# EAGLE design adc_cap (EAGLE 7.0.0)
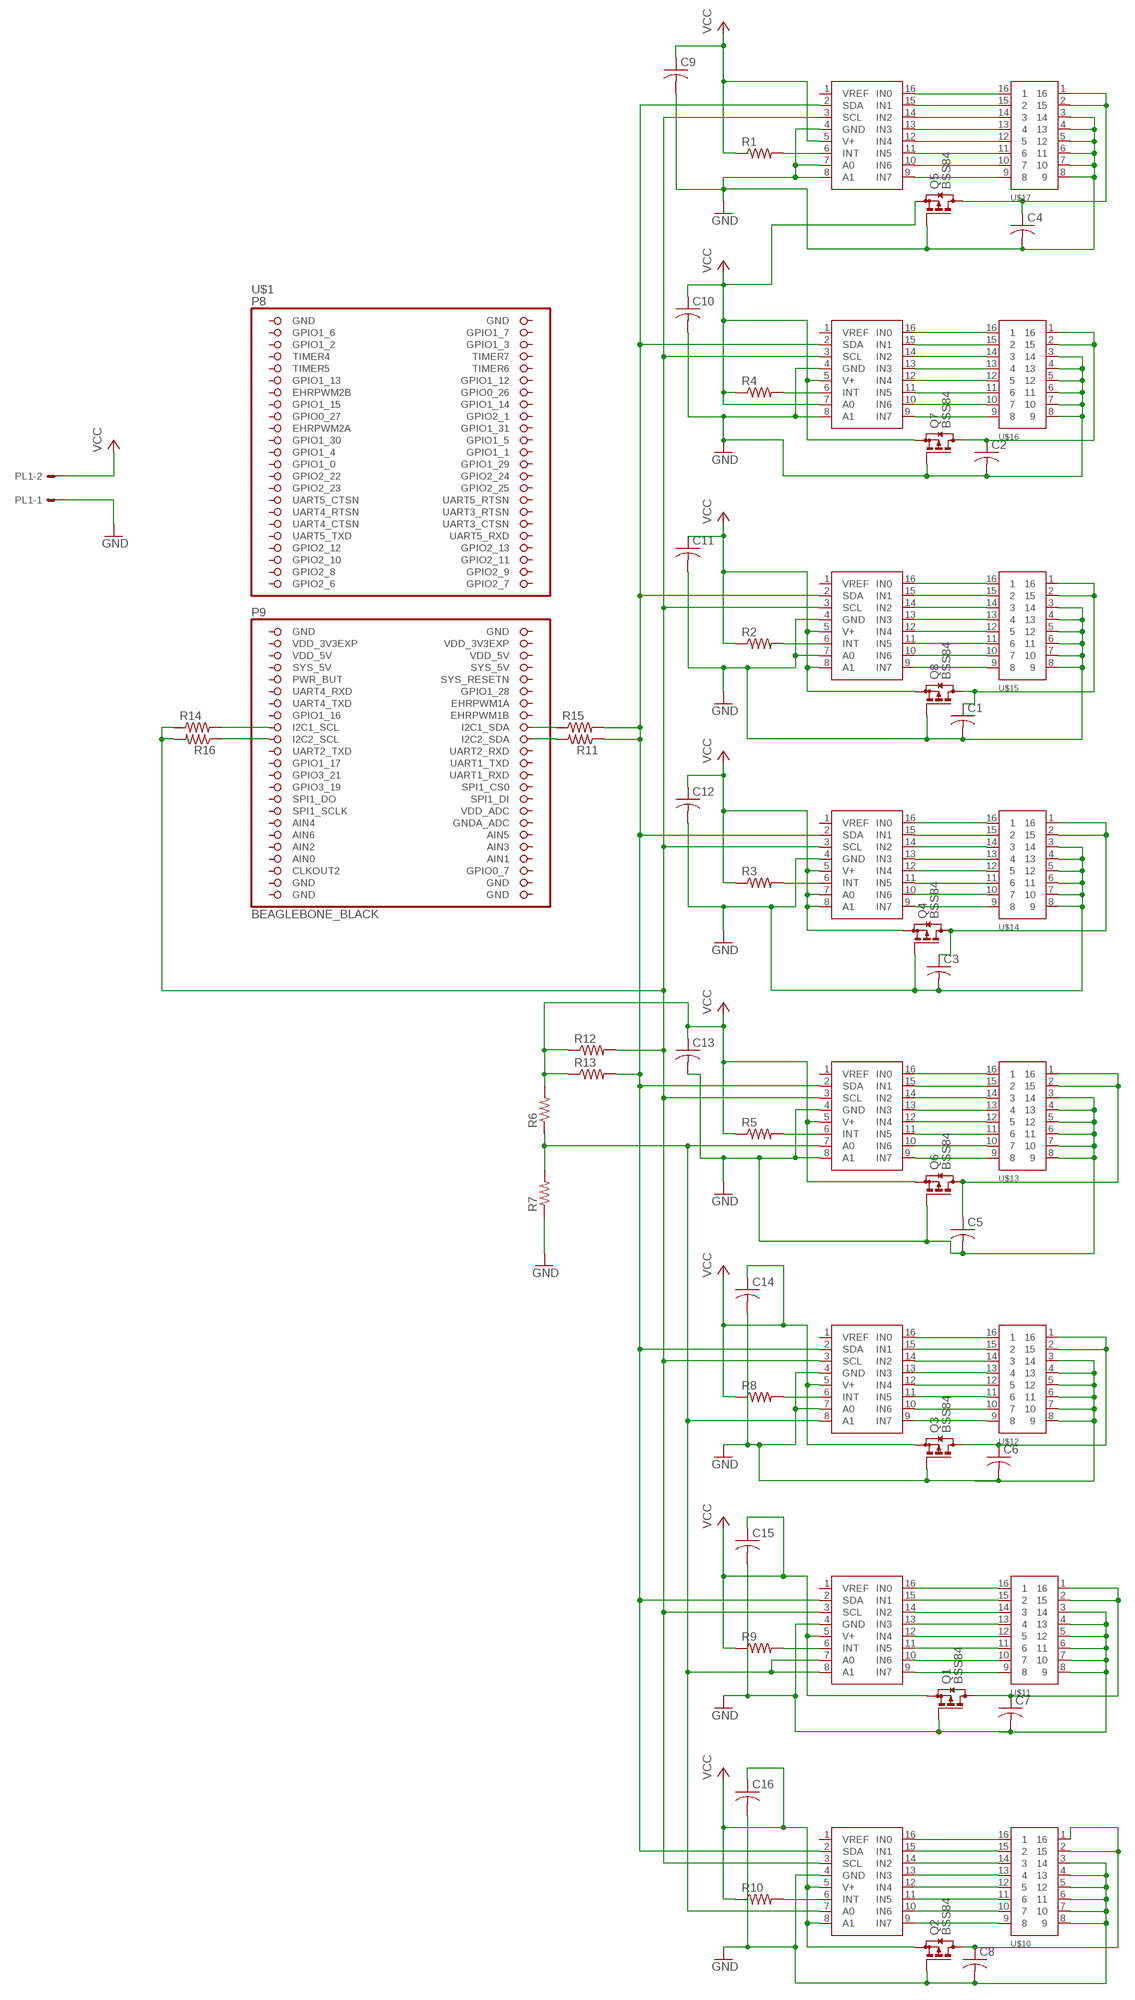
[diagram p0: schematic, sheet 1]

## Parts
C1  C-USC0805  [C0805]
C2  C-USC0805  [C0805]
C3  C-USC0805  [C0805]
C4  C-USC0805  [C0805]
C5  C-USC0805  [C0805]
C6  C-USC0805  [C0805]
C7  C-USC0805  [C0805]
C8  C-USC0805  [C0805]
C9  C-USC0805  [C0805]
C10  C-USC0805  [C0805]
C11  C-USC0805  [C0805]
C12  C-USC0805  [C0805]
C13  C-USC0805  [C0805]
C14  C-USC0805  [C0805]
C15  C-USC0805  [C0805]
C16  C-USC0805  [C0805]
PL1  555X-2H  [5569-2]
Q1  BSS84  [SOT23]
Q2  BSS84  [SOT23]
Q3  BSS84  [SOT23]
Q4  BSS84  [SOT23]
Q5  BSS84  [SOT23]
Q6  BSS84  [SOT23]
Q7  BSS84  [SOT23]
Q8  BSS84  [SOT23]
R1  R-US_R0805  [R0805]
R2  R-US_R0805  [R0805]
R3  R-US_R0805  [R0805]
R4  R-US_R0805  [R0805]
R5  R-US_R0805  [R0805]
R6  R-US_R0805  [R0805]
R7  R-US_R0805  [R0805]
R8  R-US_R0805  [R0805]
R9  R-US_R0805  [R0805]
R10  R-US_R0805  [R0805]
R11  R-US_R0805  [R0805]
R12  R-US_R0805  [R0805]
R13  R-US_R0805  [R0805]
R14  R-US_R0805  [R0805]
R15  R-US_R0805  [R0805]
R16  R-US_R0805  [R0805]
U$1  BEAGLEBONE_BLACK  [BEAGEBONE]
U$2  ADC128D818  [ADC12_SD]
U$3  ADC128D818  [ADC12_SD]
U$4  ADC128D818  [ADC12_SD]
U$5  ADC128D818  [ADC12_SD]
U$6  ADC128D818  [ADC12_SD]
U$7  ADC128D818  [ADC12_SD]
U$8  ADC128D818  [ADC12_SD]
U$9  ADC128D818  [ADC12_SD]
U$10  2_X_8_CON  [2_X_8_PIN]
U$11  2_X_8_CON  [2_X_8_PIN]
U$12  2_X_8_CON  [2_X_8_PIN]
U$13  2_X_8_CON  [2_X_8_PIN]
U$14  2_X_8_CON  [2_X_8_PIN]
U$15  2_X_8_CON  [2_X_8_PIN]
U$16  2_X_8_CON  [2_X_8_PIN]
U$17  2_X_8_CON  [2_X_8_PIN]

## Nets
GND: C1.2 C2.2 C3.2 C4.2 C5.2 C6.2 C7.2 C8.2 C9.2 C10.2 C11.2 C12.2 C13.2 C14.2 C15.2 C16.2 PL1.1 Q1.1(G) Q2.1(G) Q3.1(G) Q4.1(G) Q5.1(G) Q6.1(G) Q7.1(G) Q8.1(G) R7.1 U$2.4(GND) U$2.8(A1) U$3.4(GND) U$3.7(A0) U$3.8(A1) U$4.4(GND) U$4.7(A0) U$5.4(GND) U$6.4(GND) U$6.8(A1) U$7.4(GND) U$7.7(A0) U$8.4(GND) U$9.4(GND) U$10.3 U$10.4 U$10.5 U$10.6 U$10.7 U$10.8 U$11.3 U$11.4 U$11.5 U$11.6 U$11.7 U$11.8 U$12.3 U$12.4 U$12.5 U$12.6 U$12.7 U$12.8 U$13.3 U$13.4 U$13.5 U$13.6 U$13.7 U$13.8 U$14.3 U$14.4 U$14.5 U$14.6 U$14.7 U$14.8 U$15.3 U$15.4 U$15.5 U$15.6 U$15.7 U$15.8 U$16.3 U$16.4 U$16.5 U$16.6 U$16.7 U$16.8 U$17.3 U$17.4 U$17.5 U$17.6 U$17.7 U$17.8
N$1: U$3.16(IN0) U$17.16
N$2: U$3.15(IN1) U$17.15
N$3: U$3.14(IN2) U$17.14
N$4: U$3.13(IN3) U$17.13
N$5: U$3.12(IN4) U$17.12
N$6: U$3.11(IN5) U$17.11
N$7: U$3.10(IN6) U$17.10
N$8: U$3.9(IN7) U$17.9
N$9: U$9.16(IN0) U$10.16
N$10: U$9.15(IN1) U$10.15
N$11: U$9.14(IN2) U$10.14
N$12: U$9.13(IN3) U$10.13
N$13: U$9.12(IN4) U$10.12
N$14: U$9.11(IN5) U$10.11
N$15: U$9.10(IN6) U$10.10
N$16: U$9.9(IN7) U$10.9
N$17: U$8.16(IN0) U$11.16
N$18: U$8.15(IN1) U$11.15
N$19: R4.2 U$2.6(INT)
N$20: U$8.14(IN2) U$11.14
N$21: U$8.13(IN3) U$11.13
N$22: U$8.12(IN4) U$11.12
N$23: U$8.11(IN5) U$11.11
N$24: U$8.10(IN6) U$11.10
N$25: U$8.9(IN7) U$11.9
N$26: R2.2 U$4.6(INT)
N$27: U$7.16(IN0) U$12.16
N$28: U$7.15(IN1) U$12.15
N$29: U$7.14(IN2) U$12.14
N$30: U$7.13(IN3) U$12.13
N$31: U$7.12(IN4) U$12.12
N$32: U$7.11(IN5) U$12.11
N$33: U$7.10(IN6) U$12.10
N$34: U$7.9(IN7) U$12.9
N$35: R3.2 U$5.6(INT)
N$36: U$6.16(IN0) U$13.16
N$37: U$6.15(IN1) U$13.15
N$38: U$6.14(IN2) U$13.14
N$39: U$6.13(IN3) U$13.13
N$40: U$6.12(IN4) U$13.12
N$41: U$6.11(IN5) U$13.11
N$42: U$6.10(IN6) U$13.10
N$43: U$6.9(IN7) U$13.9
N$44: R5.2 U$6.6(INT)
N$45: R6.1 R7.2 U$6.7(A0) U$7.8(A1) U$8.7(A0) U$8.8(A1) U$9.7(A0)
N$46: U$5.16(IN0) U$14.16
N$47: U$5.15(IN1) U$14.15
N$48: U$5.14(IN2) U$14.14
N$49: U$5.13(IN3) U$14.13
N$50: U$5.12(IN4) U$14.12
N$51: U$5.11(IN5) U$14.11
N$52: U$5.10(IN6) U$14.10
N$53: U$5.9(IN7) U$14.9
N$54: R8.2 U$7.6(INT)
N$55: R12.2 R14.1 R16.2 U$2.3(SCL) U$3.3(SCL) U$4.3(SCL) U$5.3(SCL) U$6.3(SCL) U$7.3(SCL) U$8.3(SCL) U$9.3(SCL)
N$56: U$4.16(IN0) U$15.16
N$57: U$4.15(IN1) U$15.15
N$58: U$4.14(IN2) U$15.14
N$59: U$4.13(IN3) U$15.13
N$60: U$4.12(IN4) U$15.12
N$61: U$4.11(IN5) U$15.11
N$62: U$4.10(IN6) U$15.10
N$63: U$4.9(IN7) U$15.9
N$64: R9.2 U$8.6(INT)
N$65: U$2.16(IN0) U$16.16
N$66: U$2.15(IN1) U$16.15
N$67: R1.2 U$3.6(INT)
N$68: U$2.14(IN2) U$16.14
N$69: U$2.13(IN3) U$16.13
N$70: U$2.12(IN4) U$16.12
N$71: U$2.11(IN5) U$16.11
N$72: U$2.10(IN6) U$16.10
N$73: U$2.9(IN7) U$16.9
N$74: R10.2 U$9.6(INT)
N$75: C4.1 Q5.3(D) U$17.1 U$17.2
N$76: C3.1 Q4.3(D) U$14.1 U$14.2
N$77: C1.1 Q8.3(D) U$15.1 U$15.2
N$78: C7.1 Q1.3(D) U$11.1 U$11.2
N$79: C2.1 Q7.3(D) U$16.1 U$16.2
N$80: R11.2 U$1.167(I2C2_SDA)
N$81: R15.1 U$1.165(I2C1_SDA)
N$82: C5.1 Q6.3(D) U$13.1 U$13.2
N$83: C8.1 Q2.3(D) U$10.1 U$10.2
N$84: R11.1 R13.2 R15.2 U$2.2(SDA) U$3.2(SDA) U$4.2(SDA) U$5.2(SDA) U$6.2(SDA) U$7.2(SDA) U$8.2(SDA) U$9.2(SDA)
N$85: R14.2 U$1.168(I2C1_SCL)
N$86: R16.1 U$1.166(I2C2_SCL)
N$87: C6.1 Q3.3(D) U$12.1 U$12.2
VCC: C9.1 C10.1 C11.1 C12.1 C13.1 C14.1 C15.1 C16.1 PL1.2 Q1.2(S) Q2.2(S) Q3.2(S) Q4.2(S) Q5.2(S) Q6.2(S) Q7.2(S) Q8.2(S) R1.1 R2.1 R3.1 R4.1 R5.1 R6.2 R8.1 R9.1 R10.1 R12.1 R13.1 U$2.5(V+) U$2.7(A0) U$3.5(V+) U$4.5(V+) U$4.8(A1) U$5.5(V+) U$5.7(A0) U$5.8(A1) U$6.5(V+) U$7.5(V+) U$8.5(V+) U$9.5(V+) U$9.8(A1)
Unconnected: U$1.93(GPIO2_7) U$1.94(GPIO2_6) U$1.95(GPIO2_9) U$1.96(GPIO2_8) U$1.97(GPIO2_11) U$1.98(GPIO2_10) U$1.99(GPIO2_13) U$1.100(GPIO2_12) U$1.101(UART5_RXD) U$1.102(UART5_TXD) U$1.103(UART3_CTSN) U$1.104(UART4_CTSN) U$1.105(UART3_RTSN) U$1.106(UART4_RTSN) U$1.107(UART5_RTSN) U$1.108(UART5_CTSN) U$1.109(GPIO2_25) U$1.110(GPIO2_23) U$1.111(GPIO2_24) U$1.112(GPIO2_22) U$1.113(GPIO1_29) U$1.114(GPIO1_0) U$1.115(GPIO1_1) U$1.116(GPIO1_4) U$1.117(GPIO1_5) U$1.118(GPIO1_30) U$1.119(GPIO1_31) U$1.120(EHRPWM2A) U$1.121(GPIO2_1) U$1.122(GPIO0_27) U$1.123(GPIO1_14) U$1.124(GPIO1_15) U$1.125(GPIO0_26) U$1.126(EHRPWM2B) U$1.127(GPIO1_12) U$1.128(GPIO1_13) U$1.129(TIMER6) U$1.130(TIMER5) U$1.131(TIMER7) U$1.132(TIMER4) U$1.133(GPIO1_3) U$1.134(GPIO1_2) U$1.135(GPIO1_7) U$1.136(GPIO1_6) U$1.143(GPIO0_7) U$1.144(CLKOUT2) U$1.145(AIN1) U$1.147(AIN3) U$1.148(AIN2) U$1.149(AIN5) U$1.150(AIN6) U$1.151(GNDA_ADC) U$1.152(AIN4) U$1.153(VDD_ADC) U$1.154(SPI1_SCLK) U$1.155(SPI1_DI) U$1.156(SPI1_DO) U$1.157(SPI1_CS0) U$1.158(GPIO3_19) U$1.159(UART1_RXD) U$1.160(GPIO3_21) U$1.161(UART1_TXD) U$1.162(GPIO1_17) U$1.163(UART2_RXD) U$1.164(UART2_TXD) U$1.169(EHRPWM1B) U$1.170(GPIO1_16) U$1.171(EHRPWM1A) U$1.172(UART4_TXD) U$1.173(GPIO1_28) U$1.174(UART4_RXD) U$1.175(SYS_RESETN) U$1.176(PWR_BUT) U$1.177(SYS_5V) U$2.1(VREF) U$3.1(VREF) U$4.1(VREF) U$5.1(VREF) U$6.1(VREF) U$7.1(VREF) U$8.1(VREF) U$9.1(VREF)

## Power pins joined to a net without a drawn wire
AIN0: U$1.146(AIN0)
GND: U$1.137(GND) U$1.138(GND) U$1.139(GND) U$1.140(GND) U$1.141(GND) U$1.142(GND) U$1.183(GND) U$1.184(GND)
SYS_5V: U$1.178(SYS_5V)
VDD_3V3EXP: U$1.181(VDD_3V3EXP) U$1.182(VDD_3V3EXP)
VDD_5V: U$1.179(VDD_5V) U$1.180(VDD_5V)

## Library data of the parts
C1-C16 = rcl:C-US: CAPACITOR, American symbol
PL1 = con-molex-2:555X-2: Mini FIT connector 2 way
Q1-Q8 = transistor-small-signal:BSS84: P-CHANNEL MOS FET
R1-R10 R12 R13 = adafruit:R-US_: RESISTOR, American symbol
R11 R14-R16 = rcl:R-US_: RESISTOR, American symbol
U$1 = BeagleBone:BEAGLEBONE_BLACK
U$2-U$9 = ADC128D818:ADC128D818
U$10-U$17 = 11_pin_connecterp:2_X_8_CON

## Net classes
0 default: width 2.54 mm, drill 0.508 mm, clearance 0.254 mm

## Board
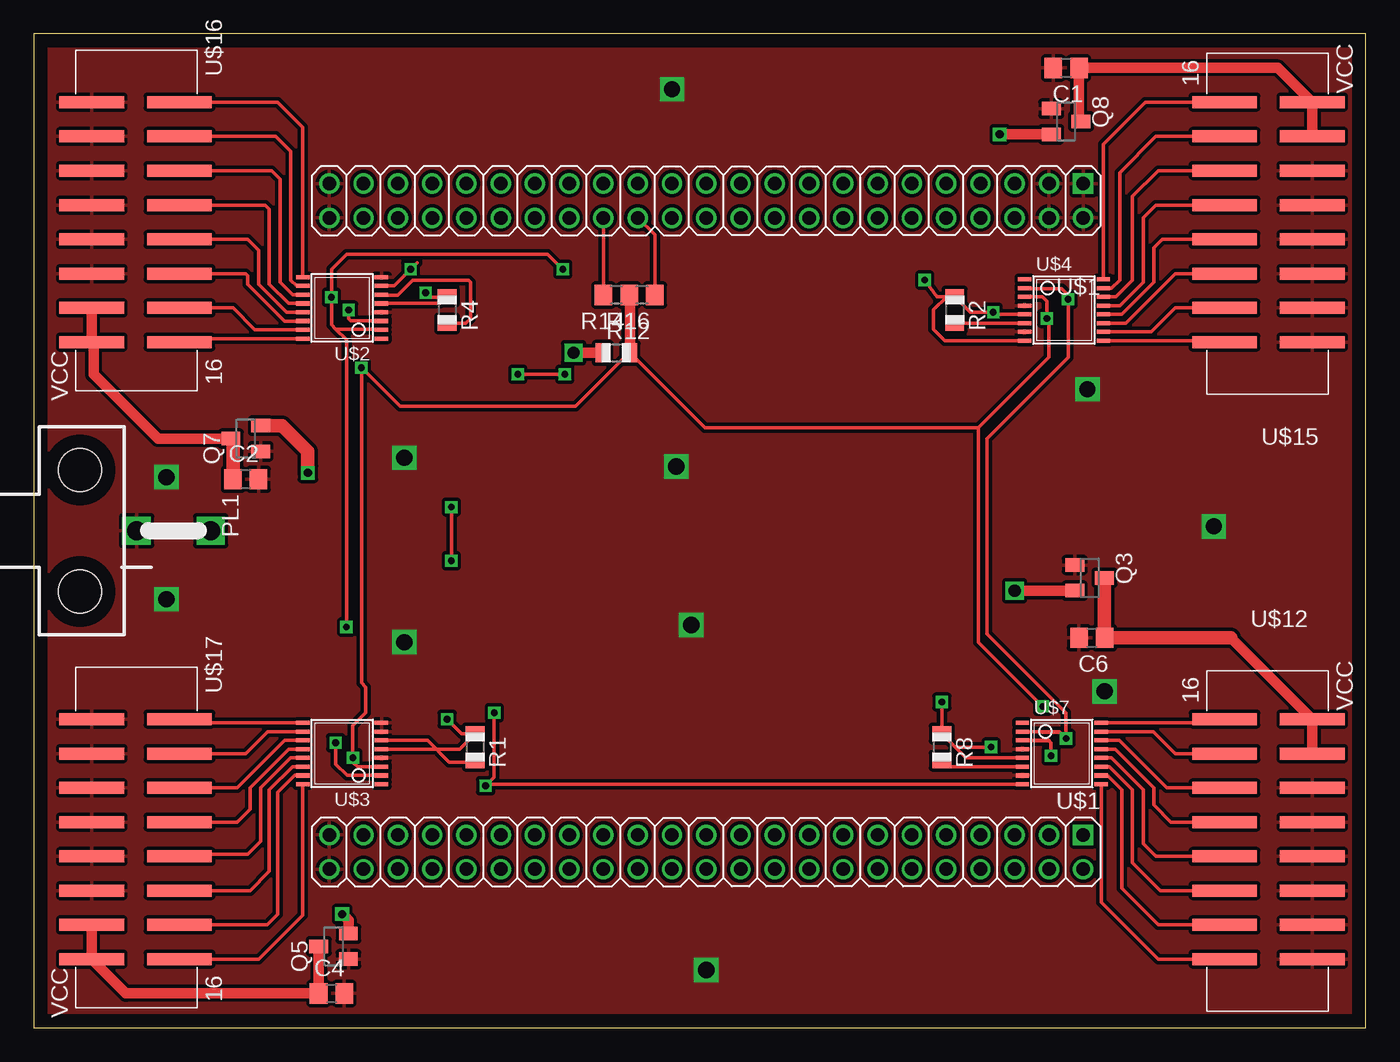
[diagram p1: board, top side]
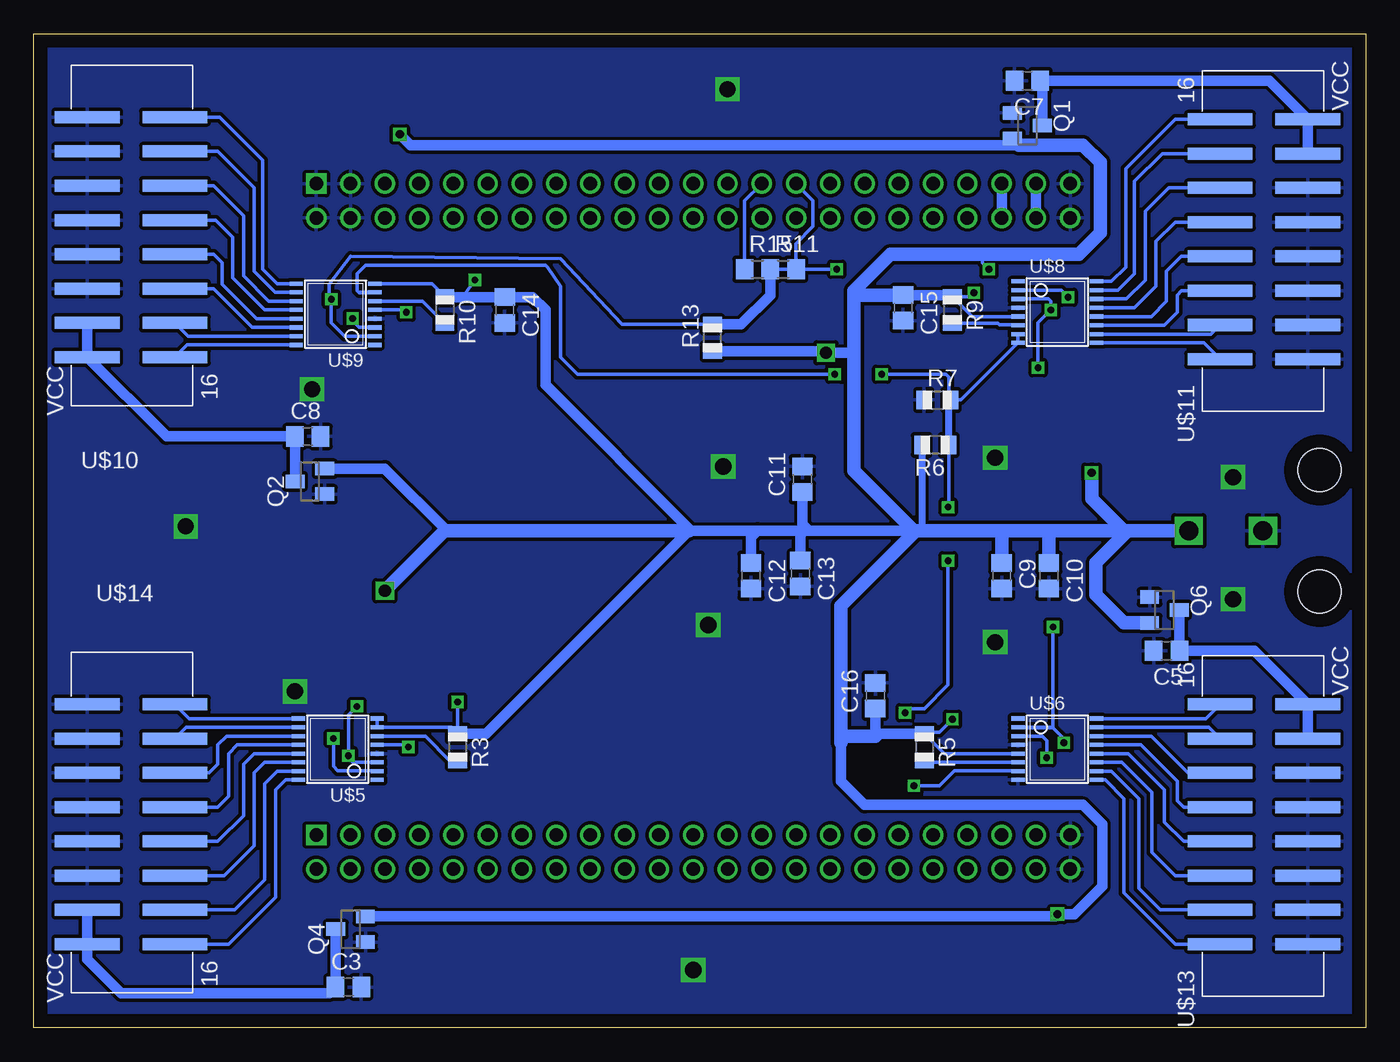
[diagram p2: board, bottom side, seen from below]

Size 98.73 x 73.65 mm. Coordinates in mm from the lower left corner, seen from the top.
Outline: 0,0 98.73,0 98.73,73.65 0,73.65 0,0
Copper layers (1*16): Top 0.035mm / dielectric 1.5mm / Bottom 0.035mm
Design rules "default": minimum track width 10mil, minimum drill 24mil, track to track 8mil, track to pad 8mil, pad to pad 8mil, via to via 8mil, smd to smd 8mil, copper to edge 40mil, drill to drill 8mil, minimum pad ring 10mil, minimum via ring 8mil, stop-mask expansion 4mil, vias tented up to drill 0mil, thermal gap 10mil

### Footprints (pad centres in the part's own frame; a part is rotated, then mirrored left to right if it is on the bottom)
C0805 = smd 1.3 x 1.5: 1 -0.95,0; 2 0.95,0
5569-2 = drill 1.4 square: 1 0,0; 2 0,5.5 | hole 3.2: 4.5,-4.2; -4.5,-4.2
SOT23 = smd 1 x 1.4: 1 -0.95,-1.1; 2 0.95,-1.1; 3 0,1.1
R0805 = smd 1.1 x 1.4: 1 -1,0; 2 1,0
R0805' = smd 1.3 x 1.5: 1 -0.95,0; 2 0.95,0
BEAGEBONE = drill 1 square: 93 -22.225,-33.02; 139 26.035,-33.02 | drill 1: 94 -24.765,-33.02; 95 -22.225,-30.48; 96 -24.765,-30.48; 97 -22.225,-27.94; 98 -24.765,-27.94; 99 -22.225,-25.4; 100 -24.765,-25.4; 101 -22.225,-22.86; 102 -24.765,-22.86; 103 -22.225,-20.32; 104 -24.765,-20.32; 105 -22.225,-17.78; 106 -24.765,-17.78; 107 -22.225,-15.24; 108 -24.765,-15.24; 109 -22.225,-12.7; 110 -24.765,-12.7; 111 -22.225,-10.16; 112 -24.765,-10.16; 113 -22.225,-7.62; 114 -24.765,-7.62; 115 -22.225,-5.08; 116 -24.765,-5.08; 117 -22.225,-2.54; 118 -24.765,-2.54; 119 -22.225,0; 120 -24.765,0; 121 -22.225,2.54; 122 -24.765,2.54; 123 -22.225,5.08; 124 -24.765,5.08; 125 -22.225,7.62; 126 -24.765,7.62; 127 -22.225,10.16; 128 -24.765,10.16; 129 -22.225,12.7; 130 -24.765,12.7; 131 -22.225,15.24; 132 -24.765,15.24; 133 -22.225,17.78; 134 -24.765,17.78; 135 -22.225,20.32; 136 -24.765,20.32; 137 -22.225,22.86; 138 -24.765,22.86; 140 23.495,-33.02; 141 26.035,-30.48; 142 23.495,-30.48; 143 26.035,-27.94; 144 23.495,-27.94; 145 26.035,-25.4; 146 23.495,-25.4; 147 26.035,-22.86; 148 23.495,-22.86; 149 26.035,-20.32; 150 23.495,-20.32; 151 26.035,-17.78; 152 23.495,-17.78; 153 26.035,-15.24; 154 23.495,-15.24; 155 26.035,-12.7; 156 23.495,-12.7; 157 26.035,-10.16; 158 23.495,-10.16; 159 26.035,-7.62; 160 23.495,-7.62; 161 26.035,-5.08; 162 23.495,-5.08; 163 26.035,-2.54; 164 23.495,-2.54; 165 26.035,0; 166 23.495,0; 167 26.035,2.54; 168 23.495,2.54; 169 26.035,5.08; 170 23.495,5.08; 171 26.035,7.62; 172 23.495,7.62; 173 26.035,10.16; 174 23.495,10.16; 175 26.035,12.7; 176 23.495,12.7; 177 26.035,15.24; 178 23.495,15.24; 179 26.035,17.78; 180 23.495,17.78; 181 26.035,20.32; 182 23.495,20.32; 183 26.035,22.86; 184 23.495,22.86
ADC12_SD = smd 0.305 x 0.991: 1 -2.275,-2.918; 2 -1.625,-2.918; 3 -0.975,-2.918; 4 -0.325,-2.918; 5 0.325,-2.918; 6 0.975,-2.918; 7 1.625,-2.918; 8 2.275,-2.918; 9 2.275,2.918; 10 1.625,2.918; 11 0.975,2.918; 12 0.325,2.918; 13 -0.325,2.918; 14 -0.975,2.918; 15 -1.625,2.918; 16 -2.275,2.918
2_X_8_PIN = smd 0.89 x 4.8: 1 -8.89,3.325; 2 -6.35,3.325; 3 -3.81,3.325; 4 -1.27,3.325; 5 1.27,3.325; 6 3.81,3.325; 7 6.35,3.325; 8 8.89,3.325; 9 8.89,-3.175; 10 6.35,-3.175; 11 3.81,-3.175; 12 1.27,-3.175; 13 -1.27,-3.175; 14 -3.81,-3.175; 15 -6.35,-3.175; 16 -8.89,-3.175

### Placement (x,y rotation side)
C1  76.52,71.12 180 top
C2  15.72,40.64 0 top
C3  75.41,3.02 0 bottom
C4  22.07,2.54 0 top
C5  14.76,27.94 180 bottom
C6  78.42,28.89 180 top
C7  25.08,70.17 180 bottom
C8  78.42,43.81 0 bottom
C9  26.99,33.5 270 bottom
C10  23.5,33.5 270 bottom
C11  41.75,40.64 90 bottom
C12  45.56,33.5 270 bottom
C13  41.91,33.66 270 bottom
C14  63.82,53.18 270 bottom
C15  34.29,53.34 270 bottom
C16  36.35,24.61 90 bottom
PL1  7.62,36.83 270 top
Q1  25.08,66.83 270 bottom
Q2  78.26,40.48 90 bottom
Q3  78.26,33.34 270 top
Q4  75.25,7.3 90 bottom
Q5  22.23,6.03 90 top
Q6  14.92,30.96 270 bottom
Q7  15.72,43.66 90 top
Q8  76.52,67.15 270 top
R1  32.7,20.8 270 top
R2  68.26,53.18 270 top
R3  67.31,20.8 270 bottom
R4  30.64,53.18 270 top
R5  32.7,20.8 270 bottom
R6  31.91,43.18 180 bottom
R7  31.75,46.51 0 bottom
R8  67.31,20.8 270 top
R9  30.64,53.18 270 bottom
R10  68.26,53.18 270 bottom
R11  [R0805']  43.18,56.2 0 bottom
R12  43.18,50.01 0 top
R13  48.42,51.12 90 bottom
R14  [R0805']  43.18,54.29 180 top
R15  [R0805']  45.09,56.2 0 bottom
R16  [R0805']  45.09,54.29 180 top
U$1  44.77,36.51 90 top
U$2  22.86,53.34 90 top
U$3  22.86,20.32 90 top
U$4  76.36,53.18 270 top
U$5  76.2,20.64 90 bottom
U$6  22.86,20.64 270 bottom
U$7  76.2,20.32 270 top
U$8  22.86,53.02 270 bottom
U$9  76.36,52.86 90 bottom
U$10  91.44,58.58 90 bottom
U$11  7.62,58.42 270 bottom
U$12  91.44,13.97 270 top
U$13  7.62,15.08 270 bottom
U$14  91.44,15.08 90 bottom
U$15  91.44,59.69 270 top
U$16  7.62,59.69 90 top
U$17  7.62,13.97 90 top

### Tracks (layer width: path | path; a pad name or v marks a point on that pad's centre or on a via)
GND  (via drill 1.2)
  other vias: 48.74,29.84 47.62,41.59 49.85,4.29 47.31,69.53 87.47,37.15 9.84,31.75 9.84,40.8 27.46,28.57 27.46,42.23 78.11,47.31 79.38,24.92
  pour Top (isolate 0.254): -2.54,75.09 103.03,75.09 103.03,-3.17 -2.54,-3.17
  pour Bottom (isolate 0.254): -2.86,76.68 103.66,76.68 103.66,-3.17 -2.86,-3.17
N$1
  Top 0.254: U$3.16 19.94,8.35 16.67,5.08 U$17.16
N$2
  Top 0.254: U$3.15 19.33,18.7 18.1,17.46 18.1,8.41 17.3,7.62 U$17.15
N$3
  Top 0.254: U$3.14 19.19,19.34 17.46,17.62 17.46,11.59 16.03,10.16 U$17.14
N$4
  Top 0.254: U$3.13 19.04,20 16.83,17.78 16.83,13.81 15.88,12.86 10.95,12.86 U$17.13
N$5
  Top 0.254: U$3.12 18.9,20.64 16.03,17.78 16.03,16.19 15.08,15.24 U$17.12
N$6
  Top 0.254: U$3.11 18.6,21.3 15.08,17.78 U$17.11
N$7
  Top 0.254: U$3.10 17.34,21.95 15.72,20.32 U$17.10
N$8
  Top 0.254: U$3.9 11.06,22.59 U$17.9
N$9
  Bottom 0.254: U$9.16 87.36,50.59 U$10.16
N$10
  Bottom 0.254: U$9.15 87.28,51.24 U$10.15
N$11
  Bottom 0.254: U$9.14 82.53,51.89 85.41,54.77 U$10.14
N$12
  Bottom 0.254: U$9.13 82.22,52.54 84.77,55.09 84.77,56.67 85.41,57.31 U$10.13
N$13
  Bottom 0.254: U$9.12 81.61,53.19 83.98,55.56 83.98,58.58 85.25,59.85 U$10.12
N$14
  Bottom 0.254: U$9.11 81.3,53.84 83.19,55.72 83.19,60.17 85.41,62.39 U$10.11
N$15
  Bottom 0.254: U$9.10 80.84,54.49 82.39,56.04 82.39,62.23 85.09,64.93 U$10.10
N$16
  Bottom 0.254: U$9.9 80.7,55.14 81.76,56.2 81.76,64.29 84.93,67.47 U$10.9
N$17
  Bottom 0.254: U$8.16 18.84,55.3 17.78,56.36 17.78,63.66 14.13,67.31 U$11.16
N$18
  Bottom 0.254: U$8.15 18.38,54.65 17.14,55.88 17.14,62.71 15.08,64.77 U$11.15
N$19
  Top 0.254: R4.2 32.02,52.18 32.38,52.55 32.38,55.24 32.23,55.4 28.1,55.4 26.99,54.29 25.8,54.29 U$2.6
N$20
  Bottom 0.254: U$8.14 17.76,54 16.35,55.4 16.35,60.48 14.61,62.23 U$11.14
N$21
  Bottom 0.254: U$8.13 17.14,53.35 15.56,54.93 15.56,58.26 14.13,59.69 U$11.13
N$22
  Bottom 0.254: U$8.12 15.88,52.7 14.76,53.82 14.76,56.04 13.65,57.15 U$11.12
N$23
  Bottom 0.254: U$8.11 14.95,52.05 13.97,53.02 13.97,54.29 13.65,54.61 U$11.11
N$24
  Bottom 0.254: U$8.10 11.47,51.4 U$11.10
N$25
  Bottom 0.254: U$8.9 12.01,50.75 U$11.9
N$26
  Top 0.254: U$4.6 68.29,52.21 R2.2
N$27
  Top 0.254: U$7.16 88,22.59 U$12.16
N$28
  Top 0.254: U$7.15 82.99,21.95 84.61,20.32 U$12.15
N$29
  Top 0.254: U$7.14 80.46,21.3 83.98,17.78 U$12.14
N$30
  Top 0.254: U$7.13 80.16,20.64 83.03,17.78 83.03,16.51 84.3,15.24 U$12.13
N$31
  Top 0.254: U$7.12 79.86,20 82.23,17.62 82.23,13.65 83.19,12.7 U$12.12
N$32
  Top 0.254: U$7.11 79.72,19.34 81.44,17.62 81.44,12.22 83.5,10.16 U$12.11
N$33
  Top 0.254: U$7.10 79.57,18.7 80.64,17.62 80.64,10.32 83.34,7.62 U$12.10
N$34
  Top 0.254: U$7.9 79.12,9.31 83.34,5.08 U$12.9
N$35
  Bottom 0.254: U$5.6 73.26,21.59 69.69,21.59 67.9,19.8 R3.2
N$36
  Bottom 0.254: U$6.16 11.85,22.91 U$13.16
N$37
  Bottom 0.254: U$6.15 11.63,22.26 U$13.15
N$38
  Bottom 0.254: U$6.14 15.9,21.61 13.18,18.89 U$13.14
N$39
  Bottom 0.254: U$6.13 16.68,20.96 13.97,18.26 13.97,16.83 13.49,16.35 U$13.13
N$40
  Bottom 0.254: U$6.12 17.61,20.31 14.92,17.62 14.92,15.24 13.49,13.81 U$13.12
N$41
  Bottom 0.254: U$6.11 18.07,19.66 15.88,17.46 15.88,13.02 14.13,11.27 U$13.11
N$42
  Bottom 0.254: U$6.10 18.85,19.01 16.83,16.99 16.83,10.32 15.24,8.73 U$13.10
N$43
  Bottom 0.254: U$6.9 19.32,18.36 17.94,16.99 17.94,10 14.13,6.19 U$13.9
N$44
  Bottom 0.254: U$6.6 32.57,19.66 R5.2
N$45  (via drill 0.5)
  Top 0.254: v35.88,48.42 v39.37,48.42 | v30.96,34.61 v30.96,38.58 | v34.13,23.34 34.13,18.57 v33.5,17.94 33.6,18.05 U$7.8
  Bottom 0.254: R7.2 30.01,46.51 U$8.8 U$8.7 | 30.91,46.35 30.91,48.21 31.11,48.42 v35.88,48.42 | v39.37,48.42 58.42,48.42 59.69,49.69 59.69,54.93 60.64,56.36 60.8,56.52 74.14,56.52 74.77,55.88 74.77,54.61 74.65,54.49 | 74.65,54.49 74.61,54.45 73.48,54.45 U$9.7 74.65,54.49 | v30.96,34.61 30.96,25.4 32.7,23.65 33.81,23.65 v34.13,23.34 | v30.96,38.58 30.91,38.62 R6.1 | v33.5,17.94 31.59,17.94 30.48,19.05 25.82,19.05 U$6.7
  Bottom 0.508: R6.1 30.91,46.35 R7.2
N$46
  Bottom 0.254: U$5.16 80.06,18.36 80.8,17.62 80.8,9.68 84.3,6.19 U$14.16
N$47
  Bottom 0.254: U$5.15 80.68,19.01 81.6,18.1 81.6,10.95 83.82,8.73 U$14.15
N$48
  Bottom 0.254: U$5.14 81.62,19.66 82.39,18.89 82.39,13.49 84.61,11.27 U$14.14
N$49
  Bottom 0.254: U$5.13 82.4,20.31 83.19,19.53 83.19,15.72 85.09,13.81 U$14.13
N$50
  Bottom 0.254: U$5.12 83.65,20.96 84.3,20.32 84.3,17.14 85.09,16.35 U$14.12
N$51
  Bottom 0.254: U$5.11 84.43,21.61 85.09,20.95 85.09,19.53 85.72,18.89 U$14.11
N$52
  Bottom 0.254: U$5.10 87.43,22.26 U$14.10
N$53
  Bottom 0.254: U$5.9 87.21,22.91 U$14.9
N$54
  Top 0.254: U$7.6 67.76,19.34 R8.2
N$55  (via drill 0.5)
  Top 0.254: R14.1 | 75.25,21.27 75.41,21.11 v75.41,20.16 | 75.25,21.27 73.31,21.27 U$7.3 75.22,21.3 75.25,21.27 | U$4.3 74.75,54.16 75.09,53.82 v75.09,52.55 75.25,52.39 75.25,49.69 70.01,44.45 | U$3.3 23.99,19.34 23.65,19.68 v23.65,20 23.65,22.38 24.61,23.34 24.61,25.24 24.29,25.56 v24.29,48.9 27.15,46.04 40.16,46.04 44.13,50.01 R12.2 49.74,44.45 70.01,44.45 | v74.77,23.81 70.01,28.57 70.01,44.45 | v23.34,53.18 23.34,52.55 23.5,52.39 25.75,52.39 U$2.3
  Top 0.762: R12.2 44.18,54.24 R14.1
  Bottom 0.254: U$5.3 73.31,19.68 75.09,19.68 75.41,20 v75.41,20.16 75.41,23.18 v74.77,23.81 | v75.09,52.55 75.09,52.39 74.61,51.91 73.46,51.91 U$9.3 | 23.97,21.59 23.65,21.27 v23.65,20 | 23.97,21.59 25.75,21.59 U$6.3 23.99,21.61 23.97,21.59 | U$8.3 23.52,54 23.34,53.82 v23.34,53.18 24.29,52.23 v24.29,48.9
N$56
  Top 0.254: U$4.16 79.28,65.47 82.39,68.58 U$15.16
N$57
  Top 0.254: U$4.15 79.89,54.81 80.49,55.4 80.49,63.34 83.19,66.04 U$15.15
N$58
  Top 0.254: U$4.14 80.19,54.16 81.44,55.4 81.44,61.59 83.34,63.5 U$15.14
N$59
  Top 0.254: U$4.13 80.49,53.51 82.23,55.24 82.23,60.01 83.19,60.96 U$15.13
N$60
  Top 0.254: U$4.12 80.64,52.86 83.03,55.24 83.03,57.78 83.66,58.42 U$15.12
N$61
  Top 0.254: U$4.11 80.94,52.21 84.61,55.88 U$15.11
N$62
  Top 0.254: U$4.10 82.83,51.56 84.61,53.34 U$15.10
N$63
  Top 0.254: U$4.9 88.16,50.91 U$15.9
N$64
  Bottom 0.254: R9.2 27.26,52.18 27.15,52.07 25.8,52.07 U$8.6
N$65
  Top 0.254: U$2.16 11.06,51.06 U$16.16
N$66
  Top 0.254: U$2.15 16.39,51.72 14.76,53.34 U$16.15
N$67
  Top 0.254: U$3.6 29.19,21.3 30.8,19.68 32.59,19.68 R1.2
N$68
  Top 0.254: U$2.14 18.6,52.37 15.88,55.09 15.88,55.72 15.72,55.88 U$16.14
N$69
  Top 0.254: U$2.13 18.74,53.02 16.67,55.09 16.67,57.63 15.88,58.42 U$16.13
N$70
  Top 0.254: U$2.12 18.88,53.66 17.46,55.09 17.46,60.64 17.14,60.96 U$16.12
N$71
  Top 0.254: U$2.11 19.19,54.31 18.26,55.24 18.26,62.87 17.62,63.5 U$16.11
N$72
  Top 0.254: U$2.10 19.49,54.97 19.05,55.4 19.05,64.93 17.94,66.04 U$16.10
N$73
  Top 0.254: U$2.9 19.94,66.73 18.1,68.58 U$16.9
N$74
  Bottom 0.254: U$9.6 69.92,53.84 R10.2
N$75
  Top 0.762: U$17.2 U$17.1 5.32,4.05 5.72,3.65 6.83,2.54 C4.1 Q5.3
N$76
  Bottom 0.762: Q4.3 76.35,3.02 C3.1 76.83,2.54 92.23,2.54 94.77,5.07 U$14.1 U$14.2
N$77
  Top 0.762: U$15.2 U$15.1 92.22,71.12 C1.1 77.47,67.3 Q8.3
N$78
  Bottom 0.762: U$11.2 U$11.1 7.15,70.17 C7.1 23.98,70.02 Q1.3
N$79
  Top 0.762: Q7.3 9.21,43.66 4.45,48.42 4.45,50.65 U$16.1 U$16.2
  Top 1.016: C2.1 14.77,43.51 Q7.3
N$80
  Bottom 0.254: R11.2 42.23,58.1 40.96,59.37 40.96,61.28 U$1.167
N$81
  Bottom 0.254: R15.1 46.03,61.28 U$1.165
N$82
  Bottom 0.762: U$13.2 U$13.1 8.26,27.94 C5.1 13.82,27.95 Q6.3
N$83
  Bottom 0.762: U$10.2 U$10.1 88.89,43.81 C8.1 Q2.3
N$84  (via drill 0.5)
  Top 0.254: v76.52,21.43 76.04,21.91 74.77,21.91 74.73,21.95 U$7.2 76,21.95 v76.52,21.43 | U$4.2 73.48,54.77 76.2,54.77 76.68,54.29 v76.68,53.98 76.68,49.69 70.64,43.66 70.64,29.21 76.52,23.34 v76.52,21.43 | U$3.2 23.21,18.7 22.38,19.53 v22.38,21.11 | 22.38,51.75 22.07,52.07 v22.07,54.13 22.07,56.2 23.18,57.31 38.1,57.31 v39.21,56.2 | 22.38,51.75 25.74,51.75 U$2.2 | v23.18,29.69 23.18,50.96 22.38,51.75
  Bottom 0.254: 25.12,54.65 U$8.2 22.58,54.65 v22.07,54.13 | U$5.2 73.32,19.05 76.2,19.05 76.52,19.37 v76.52,21.43 | U$9.2 75.69,51.24 76.68,52.23 v76.68,53.98 76.83,54.13 76.83,55.09 75.25,57.15 59.69,56.99 55.13,52.12 R13.2 | v22.38,21.11 22.38,21.43 23.18,22.23 | 23.18,22.23 25.74,22.23 U$6.2 23.21,22.26 23.18,22.23 | 23.18,22.23 v23.18,29.69 | v39.21,56.2 R15.2 | R15.2 | R15.2
  Bottom 0.762: R13.2 46.31,52.12 44.13,54.29 R15.2
N$85
  Top 0.254: R14.2 U$1.168
N$86
  Top 0.254: R16.1 46.03,58.74 U$1.166
N$87
  Top 0.762: 88.73,28.89 U$12.1 U$12.2
  Top 1.016: 88.73,28.89 C6.1 79.37,33.33 Q3.3
VCC  (via drill 0.5, 0.6, 0.9)
  Top 0.254: U$3.5 31.55,20.64 R5.1 31.7,21.8 v30.64,22.86 | U$2.5 30.12,53.66 R9.1 30.59,54.13 29.21,54.13 29.05,54.29 v29.05,54.45 | U$2.7 26.71,54.97 v27.94,56.2 28.42,56.67 | U$4.8 67.52,50.91 66.67,51.75 66.67,53.18 67.67,54.18 R10.1 | R10.1 69.42,53.02 v71.12,53.02 71.29,52.86 U$4.5 | U$7.5 69.1,20 R8.1 | v70.96,20.8 68.31,20.8 R8.1 | v67.31,24.13 R8.1 | R10.1 66.94,54.18 v66.04,55.4
  Top 0.762: Q5.2 23.32,7.95 v22.86,8.41 | Q8.2 v71.6,66.2 | v72.71,32.38 Q3.2 | R12.1 v40.01,50.01
  Top 1.016: v20.32,41.12 20.32,42.7 18.41,44.61 Q7.2
  Bottom 0.254: 36.15,21.8 C16.1 | U$9.8 69.22,55.14 R10.1 68.15,54.29 66.83,54.29 v66.04,55.4 | U$6.5 31.22,20.31 R5.1 32.59,21.91 31.59,21.91 v30.64,22.86 | 28.42,57.31 28.42,56.67 v27.94,56.2 | U$8.5 29.16,52.7 R9.1 29.32,54.18 v29.05,54.45 | U$9.5 71.29,53.19 v71.12,53.02 | U$5.8 U$5.7 67.78,22.26 R8.1 v67.31,24.13 | U$5.5 71.13,20.96 v70.96,20.8
  Bottom 0.508: R6.2 32.91,37.04 32.7,36.83
  Bottom 0.762: 38.42,21.59 38.89,21.11 38.89,18.26 37.15,16.51 20.95,16.51 19.53,15.08 19.53,10.48 21.59,8.41 v22.86,8.41 23.02,8.25 Q4.2 | 36.35,21.59 C16.1 | v71.6,66.2 70.8,65.41 25.4,65.41 | 50.01,36.83 45.09,36.83 | 45.09,36.83 41.59,36.83 | 41.59,36.83 41.27,36.83 | 41.27,36.83 33.66,36.83 33.58,36.91 | 50.01,36.83 50.16,36.83 65.2,21.8 R8.1 | 50.01,36.83 60.8,47.62 60.8,53.18 61.75,54.13 C14.1 68.21,54.13 R10.1 | 36.15,21.8 R5.1 | C15.1 30.75,54.29 R9.1 | Q2.2 72.7,41.43 68.1,36.83 | C11.1 41.75,37.31 41.27,36.83 | C13.1 41.91,36.51 41.59,36.83 | C12.1 45.56,36.35 45.09,36.83 | 37.94,49.69 38.26,50.01 v40.01,50.01 40.12,50.12 R13.1
  Bottom 1.016: Q1.2 25.7,65.41 25.4,65.41 20.95,65.41 19.68,64.14 19.68,58.9 21.27,57.31 28.42,57.31 35.24,57.31 37.94,54.61 37.94,54.13 | PL1.2 17.62,36.83 | 17.94,36.83 23.34,36.83 | 23.34,36.83 26.99,36.83 | 26.99,36.83 32.7,36.83 33.34,36.83 33.42,36.75 | Q6.2 17.94,30 20,32.07 20,34.45 17.62,36.83 | 17.62,36.83 17.94,36.83 | 17.94,36.83 20.32,39.21 v20.32,41.12 | 38.89,21.11 38.89,31.27 33.42,36.75 | 37.94,54.13 37.94,49.69 37.94,41.27 33.58,36.91 33.42,36.75 | C15.1 37.78,54.29 37.94,54.13 | 36.35,21.59 38.42,21.59 | C9.1 26.99,36.83 | C10.1 23.5,36.67 23.34,36.83 | 50.16,36.83 68.1,36.83 68.26,36.83 v72.71,32.38
VDD_3V3EXP
  Bottom 0.762: U$1.182 U$1.181
VDD_5V
  Bottom 0.762: U$1.180 U$1.179